# Altium schematic sheet 100068622_block_diagram.SchDoc
size 863 x 558 mm; SheetNumber: 1; SheetTotal: 6
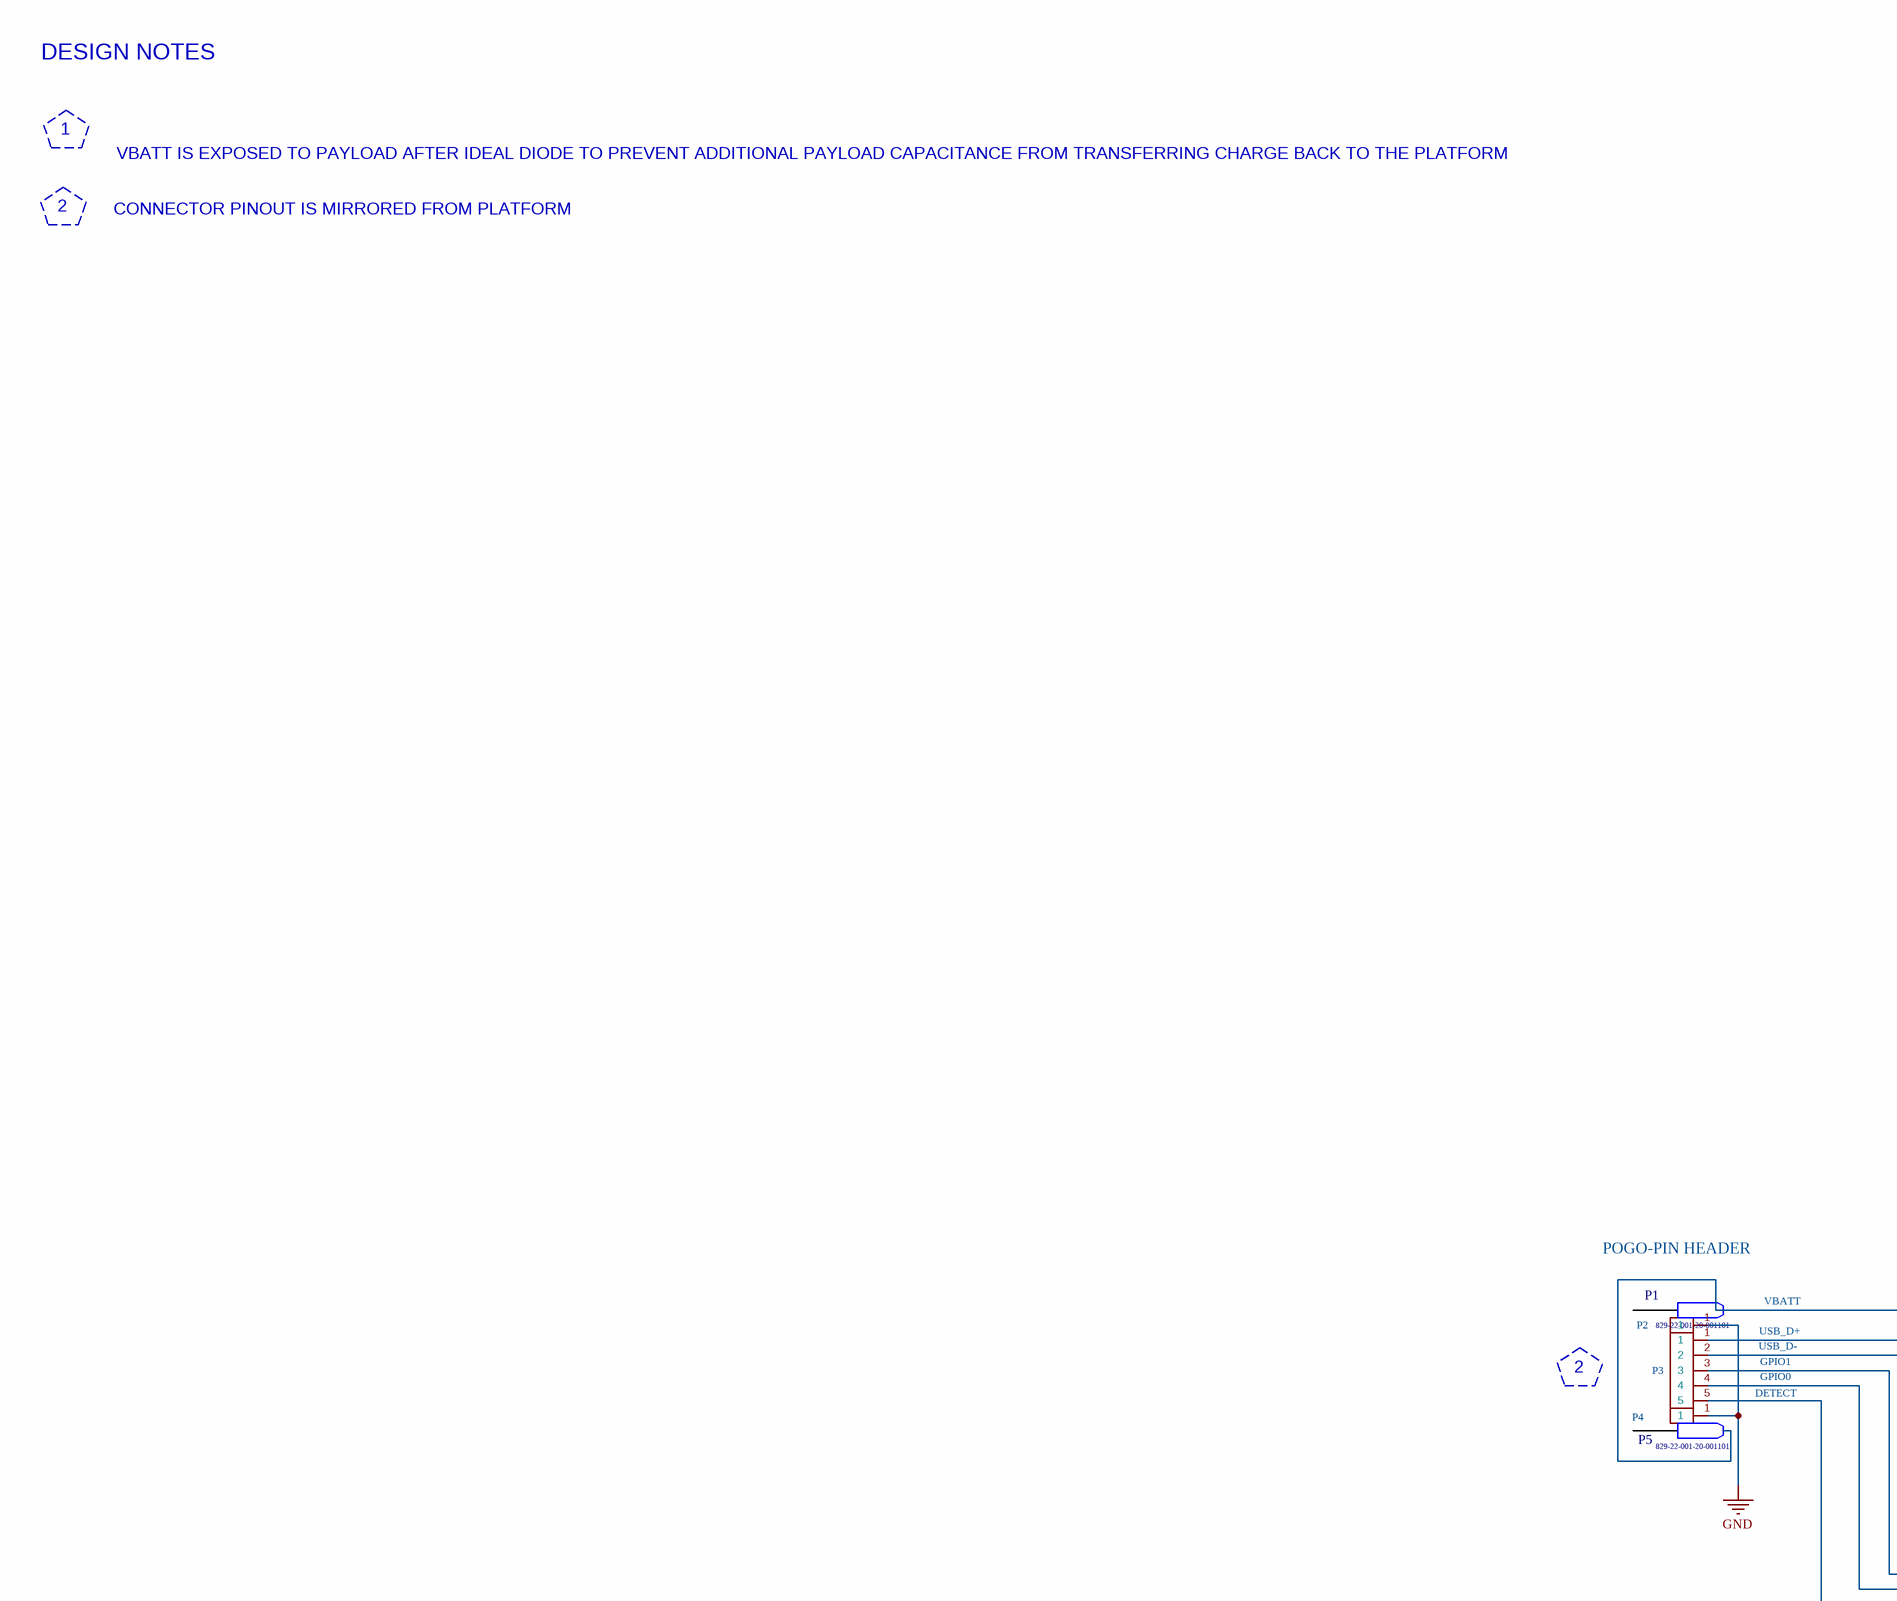
[diagram p0: 100068622_block_diagram.SchDoc, left]
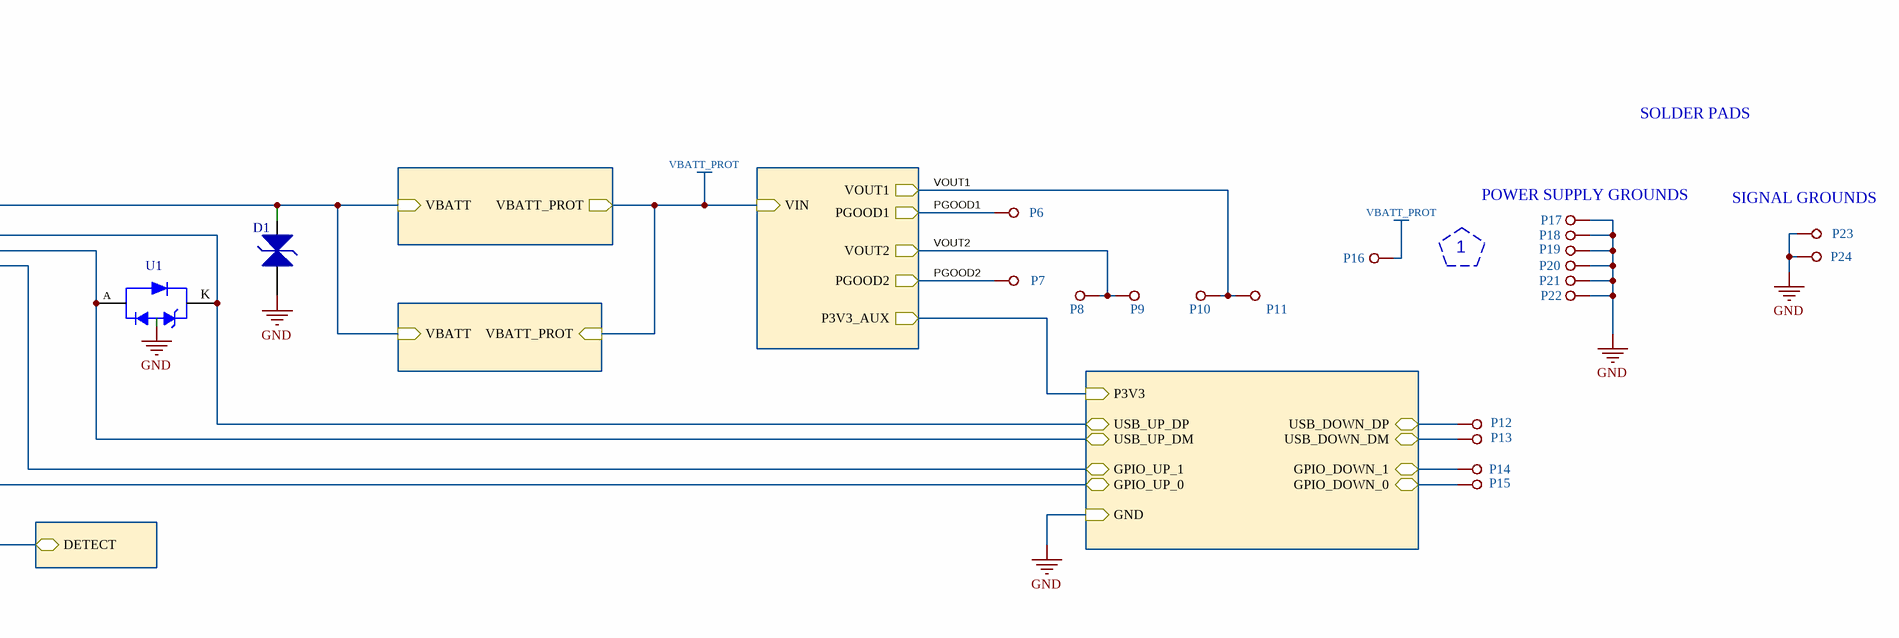
[diagram p1: 100068622_block_diagram.SchDoc, right]

## Parts
D1  SMF26A  [DI-SOD123F-A]  (value not drawn)
P1  (no value)  [829-22-001-20-001101-Footprint-1]
P2  ~  [829-22-001-20-002101]  (value not drawn)
P3  ~  [829-22-005-20-001101]  (value not drawn)
P4  ~  [829-22-001-20-002101]  (value not drawn)
P5  (no value)  [829-22-001-20-001101-Footprint-1]
P6  ~  [Hand_Solder_Pad_100x80_mil]  (value not drawn)
P7  ~  [Hand_Solder_Pad_100x80_mil]  (value not drawn)
P8  ~  [Hand_Solder_Pad_100x80_mil]  (value not drawn)
P9  ~  [Hand_Solder_Pad_100x80_mil]  (value not drawn)
P10  ~  [Hand_Solder_Pad_100x80_mil]  (value not drawn)
P11  ~  [Hand_Solder_Pad_100x80_mil]  (value not drawn)
P12  ~  [Hand_Solder_Pad_100x80_mil]  (value not drawn)
P13  ~  [Hand_Solder_Pad_100x80_mil]  (value not drawn)
P14  ~  [Hand_Solder_Pad_100x80_mil]  (value not drawn)
P15  ~  [Hand_Solder_Pad_100x80_mil]  (value not drawn)
P16  ~  [Hand_Solder_Pad_200x150_mil]  (value not drawn)
P17  ~  [Hand_Solder_Pad_100x80_mil]  (value not drawn)
P18  (no value)  [Hand_Solder_Pad_100x80_mil]
P19  (no value)  [Hand_Solder_Pad_100x80_mil]
P20  (no value)  [Hand_Solder_Pad_100x80_mil]
P21  ~  [Hand_Solder_Pad_100x80_mil]  (value not drawn)
P22  ~  [Hand_Solder_Pad_200x150_mil]  (value not drawn)
P23  ~  [Hand_Solder_Pad_100x80_mil]  (value not drawn)
P24  ~  [Hand_Solder_Pad_100x80_mil]  (value not drawn)
U1  PESD5V0C2UM  [IC-SOT883-2-B]  (value not drawn)

## Sub-sheets
Data Switches = 100068622_data_switches.SchDoc: P3V3 (in), GND (in), USB_DOWN_DP (bidir), USB_DOWN_DM (bidir), USB_UP_DM (bidir), USB_UP_DP (bidir), GPIO_DOWN_1 (bidir), GPIO_DOWN_0 (bidir), GPIO_UP_1 (bidir), GPIO_UP_0 (bidir)
Ideal Diode = 100068622_ideal_diode.SchDoc: VBATT (in), VBATT_PROT (out)
Payload Detect = 100068622_payload_detect.SchDoc: DETECT (bidir)
Power Supplies = 100068622_power_supplies.SchDoc: VIN (in), VOUT1 (out), VOUT2 (out), PGOOD1 (out), PGOOD2 (out), P3V3_AUX (out)
Rail Discharge = 100068622_rail_discharge.SchDoc: VBATT (in), VBATT_PROT (in)

## Nets
GND: D1.A P2.1 P4.1 P17.1 P18.1 P19.1 P20.1 P21.1 P22.1 P23.1 P24.1 ; sheet Data Switches/GND
VBATT_PROT: P16.1 ; sheet Power Supplies/VIN, sheet Ideal Diode/VBATT_PROT, sheet Rail Discharge/VBATT_PROT
DETECT: P3.5 ; sheet Payload Detect/DETECT
PGOOD1: P6.1 ; sheet Power Supplies/PGOOD1
PGOOD2: P7.1 ; sheet Power Supplies/PGOOD2
VOUT1: P10.1 P11.1 ; sheet Power Supplies/VOUT1
VOUT2: P8.1 P9.1 ; sheet Power Supplies/VOUT2
NetD1_K: D1.K ; sheet Ideal Diode/VBATT, sheet Rail Discharge/VBATT
NetP3_1: P3.1 U1.K ; sheet Data Switches/USB_UP_DP
NetP3_2: P3.2 U1.A ; sheet Data Switches/USB_UP_DM
NetP3_3: P3.3 ; sheet Data Switches/GPIO_UP_1
NetP3_4: P3.4 ; sheet Data Switches/GPIO_UP_0
NetP12_1: P12.1 ; sheet Data Switches/USB_DOWN_DP
NetP13_1: P13.1 ; sheet Data Switches/USB_DOWN_DM
NetP14_1: P14.1 ; sheet Data Switches/GPIO_DOWN_1
NetP15_1: P15.1 ; sheet Data Switches/GPIO_DOWN_0
(unnamed): sheet Power Supplies/P3V3_AUX, sheet Data Switches/P3V3

Not connected (* = marked no-connect by the designer): P1 0; P5 0

## Notes on the sheet
- DESIGN NOTES
- 1
- VBATT IS EXPOSED TO PAYLOAD AFTER IDEAL DIODE TO PREVENT
  ADDITIONAL PAYLOAD CAPACITANCE FROM TRANSFERRING CHARGE
  BACK TO THE PLATFORM
- 2
- CONNECTOR PINOUT IS MIRRORED FROM PLATFORM
- POGO-PIN HEADER
- SOLDER PADS
- (near P17) POWER SUPPLY GROUNDS
- (near P23) SIGNAL GROUNDS
- Labels drawn without touching a wire or pin: GPIO0, GPIO1, USB_D+, USB_D-, VBATT
- DWG NO
- REVISIONS
- SH
- REVISION
- DESCRIPTION
- DATE(YEAR-MO-DA)
- APPROVED
- PART NO.
- DESIGN ACTIVITY
- US ARMY
  COMBAT CAPABILITIES DEVELOPMENT COMMAND ARMAMENTS CENTER
  PICATINNY ARSENAL, NEW JERSEY 07806-5000
- SIZE
- CAGE CODE
- DWG NO.
- D
- 19200
- SCALE
- NONE
- UNIT WT.
- ---
- SHEET
- (in symbol CONN-00404-1) 829-22-001-20-001101

## Library data of the parts
D1 = CMP-00657-1: SMF Series 200 W 26 V Uni-Directional Surface Mount TVS Diode - SOD-123F; Breakdown Voltage: 30.4V; Clamping Voltage: 42.1V; Max Breakdown Voltage: 31.9V; Max Power Dissipation: 1W; Max Reverse Leakage Current: 1µA; Max Surge Current: 4.8A; Min Breakdown Voltage: 28.9V; Number of Channels: 1; Peak Pulse Power: 1kW; Polarity: Unidirectional; Power Line Protection: No; Reverse Standoff Voltage: 26V; Test Current: 1mA; Footprint: 1a_Littelfuse:SOD-123FL; Composition: Zener; Lead Free: Lead Free; Lifecycle Status: Production; Max Operating Temperature: 150°C; Min Operating Temperature: -65°C; Mounting Technology: Surface Mount; Number of Elements: 1; Number of Terminals: 2; Number of Unidirectional Channels: 1; Packaging: Cut Tape; Peak Pulse Current: 4.8A; Peak Reverse Current: 1µA; REACH SVHC: No; Reverse Voltage: 26V; RoHS: Compliant; Schedule B: 8541100080; Termination: SMD/SMT
P1 P5 = CONN-00404-1: Conn Spring Loaded Connector HDR 1 POS Solder RA Thru-Hole 1.14mm MidStroke; Leader Qty: 5; Number of Contacts: 1; Pitch: 2.54mm; Footprint: 1a_MillMax:829-22-001-20-001101; Case/Package: SIP; Contact Gender: Male; Contact Plating: Gold; Country of Origin: USA; Lifecycle Status: Production; Mounting Technology: Through Hole; Number of Rows: 1; System: Connector; Termination: Through Hole
P2 P4 = 829-22-001-20-002101: Manufacturer: Mill-Max; MPN: 829-22-001-20-002101; Footprint: 1a_MillMax:829-22-001-20-002101
P3 = 829-22-005-20-001101: Manufacturer: Mill-Max; MPN: 829-22-005-20-001101; Footprint: 1a_MillMax:829-22-005-20-001101
P6-P15 P17-P21 P23 P24 = Hand_Solder_Pad_100x80_mil: Footprint: 1a_Misc:Hand_Solder_Pad_100x80_mil
P16 P22 = Hand_Solder_Pad_200x100_mil: Footprint: 1a_Misc:Hand_Solder_Pad_200x150_mil
U1 = CMP-00652-1: Extremely low capacitance unidirectional ESD protection diode array; Manufacturer Lifecycle Status: RELEASED FOR SUPPLY; Footprint: Package_DFN_QFN:Diodes_DFN1006-3; Lifecycle Status: Production